# EAGLE design SHT4x (EAGLE 9.6.2)
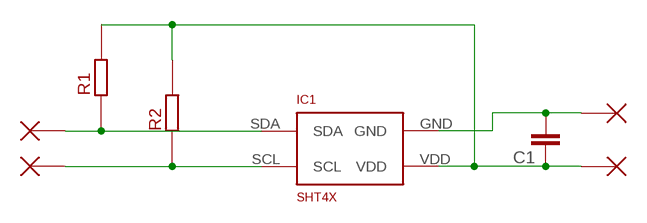
[diagram p0: schematic, sheet 1]

## Parts
C1  SMD-C-1206  [C1206]
IC1  SHT4X  [SHT4X]
P1  PIN  [PIN]
P2  PIN  [PIN]
P3  PIN  [PIN]
P4  PIN  [PIN]
R1  SMD-RR0603  [R0603]
R2  SMD-RR0603  [R0603]

## Nets
GND: C1.2 IC1.GND P3.P$1
SCL: IC1.SCL P2.P$1 R2.1
SDA: IC1.SDA P1.P$1 R1.1
VDD: C1.1 IC1.VDD P4.P$1 R1.2 R2.2

## Library data of the parts
C1 = Standardbauteile:SMD-C-1206
IC1 = Microcontroller-Periphery:SHT4X
P1-P4 = Mechanik:PIN
R1 R2 = Standardbauteile:SMD-R

## Board
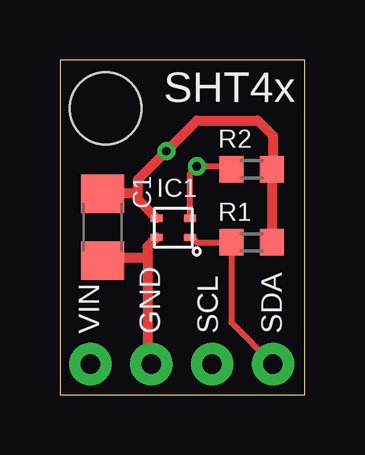
[diagram p1: board, top side]
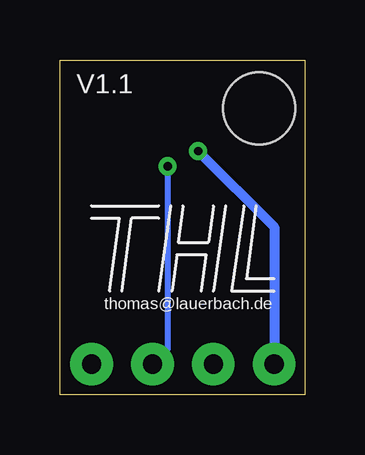
[diagram p2: board, bottom side, seen from below]

Size 10.21 x 13.96 mm. Coordinates in mm from the lower left corner, seen from the top.
Outline: 0,0 10.21,0 10.21,13.96 0,13.96 0,0
Copper layers (1*16): Top 0.035mm / dielectric 1.5mm / Bottom 0.035mm
Design rules "default": minimum track width 6mil, minimum drill 0.35mm, track to track 6mil, track to pad 6mil, pad to pad 6mil, via to via 6mil, smd to smd 6mil, copper to edge 40mil, drill to drill 6mil, minimum pad ring 10mil, minimum via ring 8mil, stop-mask expansion 4mil, vias tented up to drill 0mil, thermal gap 10mil
Holes 3 mm at 1.91,11.94

### Footprints (pad centres in the part's own frame; a part is rotated, then mirrored left to right if it is on the bottom)
C1206 = smd 1.6 x 1.8: 1 -1.4,0; 2 1.4,0
SHT4X = smd 0.5 x 0.3: GND 0.67,0.43; SCL -0.73,-0.37; SDA -0.73,0.43; VDD 0.67,-0.37
PIN = drill 0.8 pad 1.778: P$1 0,0
R0603 = smd 1 x 1.1: 1 -0.85,0; 2 0.85,0

### Placement (x,y rotation side)
C1  1.78,6.99 270 top
IC1  4.7,6.99 180 top
P1  8.89,1.27 0 top
P2  6.35,1.27 0 top
P3  3.81,1.27 0 top
P4  1.27,1.27 0 top
R1  8,6.35 0 top
R2  8,9.4 0 top
U$1  [THL-SMALL]  5.08,6.35 0 bottom

### Tracks (layer width: path | path; a pad name or v marks a point on that pad's centre or on a via)
GND
  Top 0.406: 3.65,5.71 3.65,1.43 P3.P$1 | C1.2 1.91,5.71 3.65,5.71 | IC1.GND 3.65,6.17 3.65,5.71
SCL  (via drill 0.35)
  Top 0.254: R2.1 7.02,9.53 v5.71,9.53 5.43,9.24 IC1.SCL
  Bottom 0.254: P2.P$1 5.71,1.91 v5.71,9.53
SDA
  Top 0.254: IC1.SDA 5.51,6.55 5.71,6.35 R1.1 7.15,3.01 P1.P$1
VDD  (via drill 0.35)
  Top 0.406: 3.25,8.38 C1.1 | 3.25,8.38 3.25,8.97 v4.45,10.16 5.71,11.43 8.26,11.43 8.89,10.79 8.89,9.44 R2.2 R1.2 | IC1.VDD 3.25,8.13 3.25,8.38
  Bottom 0.406: v4.45,10.16 1.27,6.99 P4.P$1

### Text on the board
tNames: SHT4x | VIN | GND | SCL | SDA
bNames: V1.1